# EAGLE design single supply control V13 SD4 (EAGLE 9.6.2)
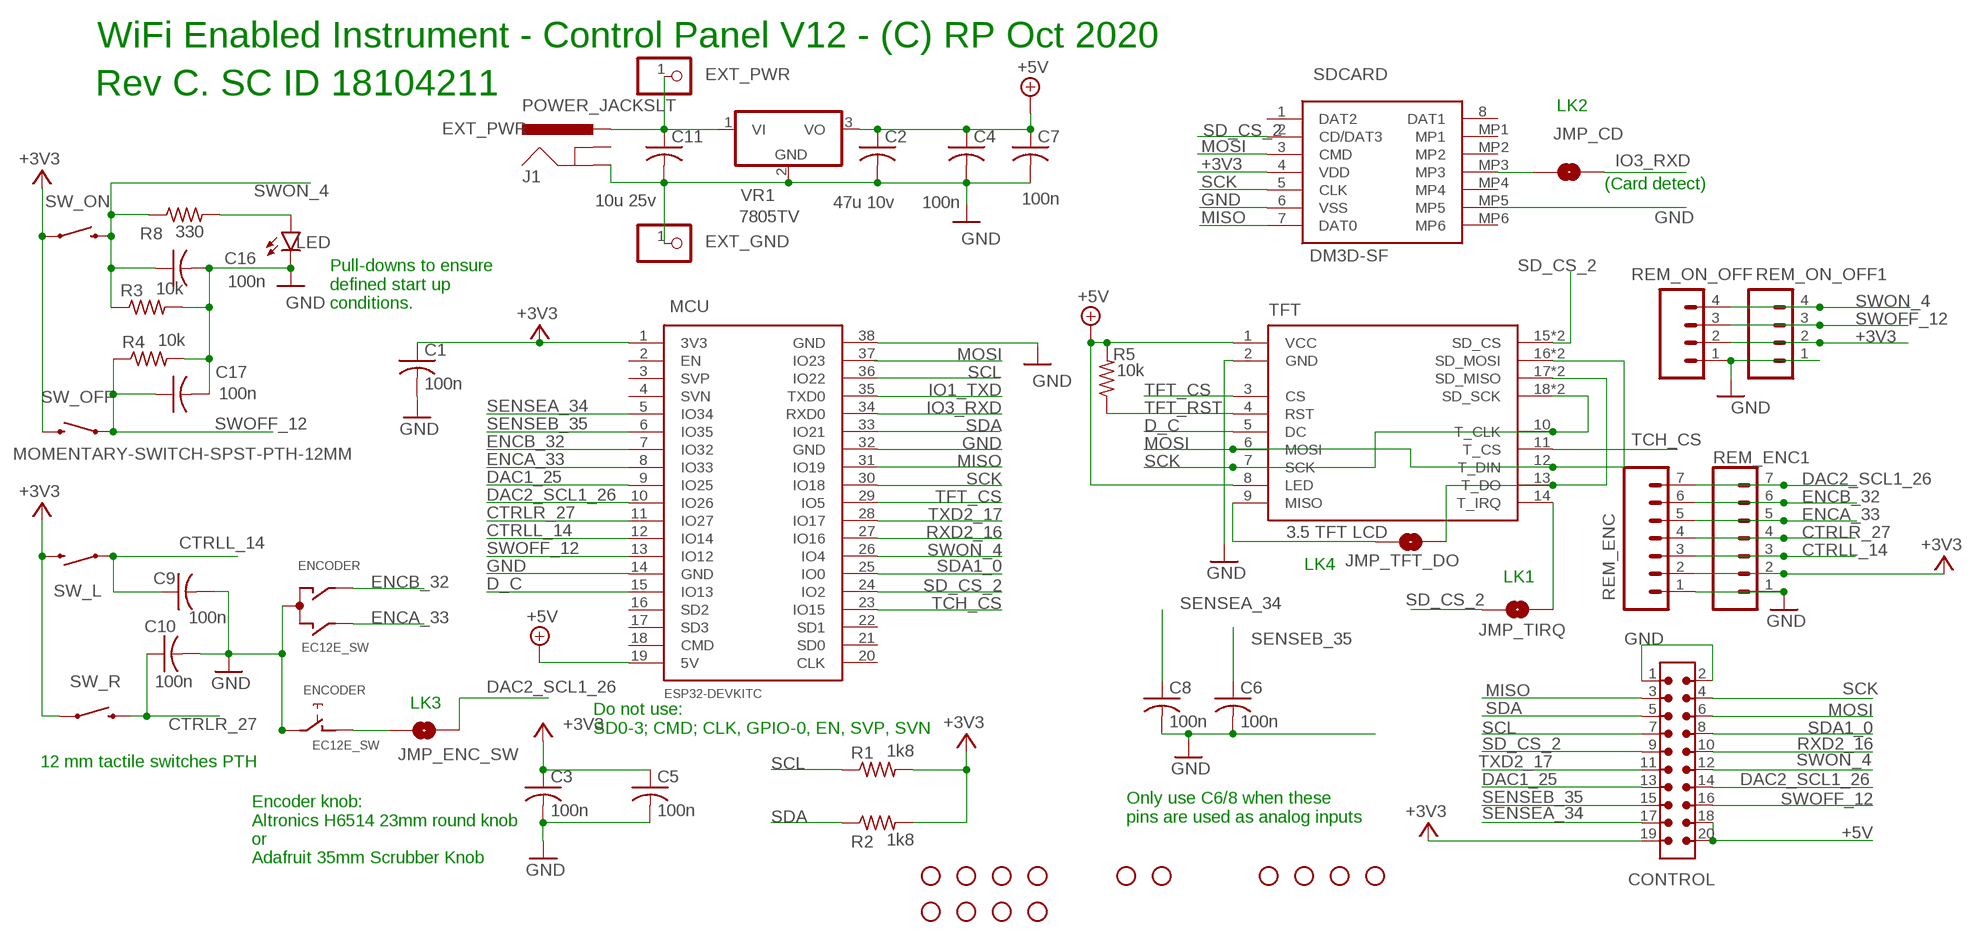
[diagram p0: schematic, sheet 1]

## Parts
C1  100n  C-USC0805K  [C0805K]
C2  47u 10v  C-USC1210K  [C1210K]
C3  100n  C-USC0805K  [C0805K]
C4  100n  C-USC0805K  [C0805K]
C5  100n  C-USC0805K  [C0805K]
C6  100n  C-USC0805K  [C0805K]
C7  100n  C-USC0805K  [C0805K]
C8  100n  C-USC0805K  [C0805K]
C9  100n  C-USC0805K  [C0805K]
C10  100n  C-USC0805K  [C0805K]
C11  10u 25v  C-USC1210K  [C1210K]
C16  100n  C-USC0805K  [C0805K]
C17  100n  C-USC0805K  [C0805K]
CONTROL  6120XX21621_61202021621  [61202021621]
ENCODER  EC12E_SW  [ALPS_EC12E_SW]
EXT_GND  PINHD-1X1  [1X01]
EXT_PWR  PINHD-1X1  [1X01]
H1  STAND-OFF  [STAND-OFF]
H2  STAND-OFF  [STAND-OFF]
H3  STAND-OFF  [STAND-OFF]
H4  STAND-OFF  [STAND-OFF]
H5  STAND-OFF  [STAND-OFF]
H6  STAND-OFF  [STAND-OFF]
H7  STAND-OFF  [STAND-OFF]
H8  STAND-OFF  [STAND-OFF]
H9  STAND-OFF  [STAND-OFF]
H10  STAND-OFF  [STAND-OFF]
H11  STAND-OFF  [STAND-OFF]
H12  STAND-OFF  [STAND-OFF]
H13  STAND-OFF  [STAND-OFF]
H14  STAND-OFF  [STAND-OFF]
J1  POWER_JACKSLT  [POWER_JACK_SLOT]
JMP_CD  JUMPER-SMT_2_NO_SILK  [SMT-JUMPER_2_NO_SILK]
JMP_ENC_SW  JUMPER-SMT_2_NO_SILK  [SMT-JUMPER_2_NO_SILK]
JMP_TFT_DO  JUMPER-SMT_2_NO_SILK  [SMT-JUMPER_2_NO_SILK]
JMP_TIRQ  JUMPER-SMT_2_NO_SILK  [SMT-JUMPER_2_NO_SILK]
LED  LED3MM  [LED_3MM]
MCU  ESP32DEVKITC  [ESP32-DEVKITC]
R1  1k8  R-US_R0805W  [R0805W]
R2  1k8  R-US_R0805W  [R0805W]
R3  10k  R-US_R0805W  [R0805W]
R4  10k  R-US_R0805W  [R0805W]
R5  10k  R-US_R0805W  [R0805W]
R8  330  R-US_R0805W  [R0805W]
REM_ENC  CONN_07  [1X07]
REM_ENC1  CONN_07  [1X07]
REM_ON_OFF  CONN_04  [1X04]
REM_ON_OFF1  CONN_04  [1X04]
SDCARD  DM3D-SF  [DM3DSF]
SW_L  MOMENTARY-SWITCH-SPST-PTH-12MM  [TACTILE_SWITCH_PTH_12MM]
SW_OFF  MOMENTARY-SWITCH-SPST-PTH-12MM  [TACTILE_SWITCH_PTH_12MM]
SW_ON  MOMENTARY-SWITCH-SPST-PTH-12MM  [TACTILE_SWITCH_PTH_12MM]
SW_R  MOMENTARY-SWITCH-SPST-PTH-12MM  [TACTILE_SWITCH_PTH_12MM]
TFT  2.8_3.5_TFT_TOUCH  [2.8_3.5_TFT_LCD]
VR1  7805TV  [TO220V]

## Nets
+3V3: C1.1 C3.1 C5.1 CONTROL.19 MCU.1(3V3) R1.2 R2.2 REM_ENC1.2 REM_ENC.2 REM_ON_OFF1.2 REM_ON_OFF.2 SDCARD.4(VDD) SW_L.3 SW_OFF.3 SW_ON.1 SW_R.1
+5V: C2.1 C4.1 C7.1 CONTROL.18 CONTROL.20 MCU.19(5V) R5.2 TFT.1(VCC) TFT.8(LED) VR1.3(VO)
CTRLL_14: C9.1 MCU.12(IO14) REM_ENC1.3 REM_ENC.3 SW_L.1
CTRLR_27: C10.1 MCU.11(IO27) REM_ENC1.4 REM_ENC.4 SW_R.3
D_C: MCU.15(IO13) TFT.5(DC)
DAC1_25: CONTROL.13 MCU.9(IO25)
DAC2_SCL1_26: CONTROL.14 JMP_ENC_SW.2 MCU.10(IO26) REM_ENC1.7 REM_ENC.7
ENC_SWX: ENCODER.D JMP_ENC_SW.1
ENCA_33: ENCODER.B MCU.8(IO33) REM_ENC1.5 REM_ENC.5
ENCB_32: ENCODER.A MCU.7(IO32) REM_ENC1.6 REM_ENC.6
EXT_PWR: C11.1 EXT_PWR.1 J1.PWR VR1.1(VI)
GND: C1.2 C2.2 C3.2 C4.2 C5.2 C6.2 C7.2 C8.2 C9.2 C10.2 C11.2 C16.2 C17.2 CONTROL.1 CONTROL.2 ENCODER.C ENCODER.E EXT_GND.1 J1.GND@2(GND) LED.K(C) MCU.14(GND) MCU.32(GND) MCU.38(GND) R3.2 R4.2 REM_ENC1.1 REM_ENC.1 REM_ON_OFF1.1 REM_ON_OFF.1 SDCARD.6(VSS) SDCARD.MP5 TFT.2(GND) VR1.2(GND)
IO1_TXD: MCU.35(TXD0)
IO3_RXD: JMP_CD.2 MCU.34(RXD0)
MISO: CONTROL.3 JMP_TFT_DO.2 MCU.31(IO19) SDCARD.7(DAT0) TFT.13(T_DO) TFT.17(SD_MISO) TFT.30(SD_MISO)
MOSI: CONTROL.6 MCU.37(IO23) SDCARD.3(CMD) TFT.6(MOSI) TFT.12(T_DIN) TFT.16(SD_MOSI) TFT.29(SD_MOSI)
N$1: JMP_CD.1 SDCARD.MP3
N$2: JMP_TFT_DO.1 TFT.9(MISO)
N$8: JMP_TIRQ.2 TFT.14(T_IRQ)
N$18: LED.A R8.2
RXD2_16: CONTROL.10 MCU.27(IO16)
SCK: CONTROL.4 MCU.30(IO18) SDCARD.5(CLK) TFT.7(SCK) TFT.10(T_CLK) TFT.18(SD_SCK) TFT.31(SD_SCK)
SCL: CONTROL.7 MCU.36(IO22) R1.1
SD_CS_2: CONTROL.9 JMP_TIRQ.1 MCU.24(IO2) SDCARD.2(CD/DAT3) TFT.15(SD_CS) TFT.28(SD_CS)
SDA: CONTROL.5 MCU.33(IO21) R2.1
SDA1_0: CONTROL.8 MCU.25(IO0)
SENSEA_34: C8.1 CONTROL.17 MCU.5(IO34)
SENSEB_35: C6.1 CONTROL.15 MCU.6(IO35)
SWOFF_12: C17.1 CONTROL.16 MCU.13(IO12) R4.1 REM_ON_OFF1.3 REM_ON_OFF.3 SW_OFF.1
SWON_4: C16.1 CONTROL.12 MCU.26(IO4) R3.1 R8.1 REM_ON_OFF1.4 REM_ON_OFF.4 SW_ON.3
TCH_CS: MCU.23(IO15) TFT.11(T_CS)
TFT_CS: MCU.29(IO5) TFT.3(CS)
TFT_RST: R5.1 TFT.4(RST)
TXD2_17: CONTROL.11 MCU.28(IO17)
Unconnected: ENCODER.GND1(G) ENCODER.GND2(G) J1.GND@1(GNDBREAK) MCU.2(EN) MCU.3(SVP) MCU.4(SVN) MCU.16(SD2) MCU.17(SD3) MCU.18(CMD) MCU.20(CLK) MCU.21(SD0) MCU.22(SD1) SDCARD.1(DAT2) SDCARD.8(DAT1) SDCARD.MP1 SDCARD.MP2 SDCARD.MP4 SDCARD.MP6

## Notes on the sheet
- WiFi Enabled Instrument - Control Panel V12 - (C) RP Oct 2020
- Rev C. SC ID 18104211
- LK2
- (Card detect)
- Pull-downs to ensure 
  defined start up 
  conditions.
- LK4
- LK1
- LK3
- Do not use:
  SD0-3; CMD; CLK, GPIO-0, EN, SVP, SVN
- 12 mm tactile switches PTH
- Only use C6/8 when these 
  pins are used as analog inputs
- Encoder knob: 
  Altronics H6514 23mm round knob 
  or
  Adafruit 35mm Scrubber Knob

## Library data of the parts
C1-C11 C16 C17 = rcl:C-US: CAPACITOR, American symbol; SPICEPREFIX: C
CONTROL = Wurth_Connectors_WR-BHD:6120XX21621_61202021621: WR-BHD 2.54 mm Male Box Header KIND PROPERTIES: Pitch 2.54 mm Gender:Male MATERIAL PROPERTIES: Insulator Material:PBT Insulator Flammability Rating UL94 V-0 Insulator Color:Black Contact Material :Copper Alloy Contact Plating :Gold Contact Type: Stamped GENERAL INFORMATION: Operating Temperature:-40 °C up to +125 °C Compliance:RoHS Working Voltage: 250 V (AC) Withstanding Voltage:500 V (AC) Contact Resistance: 20 mΩ Insulation Resistance:1000 MΩ CERTIFICATION: UL Approval:E323964 PACKAGING PROPERTIES Packaging :Tray <https://katalog.we-online.com/media/images/v2/o32884v209%20Family_WR-BHD_6120xx21621.jpg> Details see: https://katalog.we-online.com/en/em/BHD_2_54_MALE_BOX_HEADER_6120XX21621 Updated by Yingchun,Shan 2019-10-29 2019 (C) Würth Elektronik; CONTACT-RESISTANCE: 20mOhm; DATASHEET-URL: https://katalog.we-online.com/em/datasheet/61202021621.pdf; GENDER: Male; IR: 3A; L: 33.06mm; MATES: WR-BHD 2.54mm Female IDC Connector with Strain Relief; MOUNT: THT; PACKAGING: Tray; PART-NUMBER: 61202021621; PINS: 20; PITCH: 2.54mm; TOL-R: max.; TYPE: Straight; WORKING-VOLTAGE: 250V(AC)
ENCODER = switch-alps:EC12E_SW: ALPS rotary Encoder EC12E series with switch; MPN: EC12E2424407; OC_FARNELL: 1520813; OC_NEWARK: 74M1068
EXT_GND EXT_PWR = adafruit:PINHD-1X1: Pin header 1x1 for 0.1" spacing With round pins
H1-H14 = SparkFun-Hardware:STAND-OFF: Stand Off Drill holes for mechanically mounting via screws, standoffs, etc. Note: Use the keepout ring to avoid running the screw head into surrounding components. Variant Overviews STAND-OFF - Mechanical footprint for a #4 phillips button head screw. STAND-OFF-TIGHT - Mechanical footprint for a #4 phillips button head screw, Example SparkFun Products Screw - Phillips Head (1/4", 4-40, 10 pack) <https://www.sparkfun.com/products/10453> (PRT-10453) Screw - Phillips Head (1/2", 4-40, 10 pack) <https://www.sparkfun.com/products/10452> (PRT-10452) Screw - Phillips Head (3/4", 4-40, 10 pack) <https://www.sparkfun.com/products/10451> (PRT-10451) Screw - Phillips Head (1", 4-40, 10 pack) <https://www.sparkfun.com/products/10450> (PRT-10450)
J1 = SparkFun-Connectors:POWER_JACK: Power Jack Connector This is the standard 5.5mm barrel jack for power. The PTH is the most common, proven, reliable, footprint. The Slot footprint only works if the mill layer is transmitted to the PCB fab house so be warned. Here are the connectors we sell at SparkFun: DC Barrel Power Jack/Connector <https://www.sparkfun.com/products/119> (PRT-00119) DC Barrel Power Jack/Connector (SMD) <https://www.sparkfun.com/products/12748> (PRT-12748) DC Barrel Jack Adapter - Breadboard Compatible <https://www.sparkfun.com/products/10811> (PRT-10811) It is used on this SparkFun product (and many, many others): SparkFun RedBoard - Programmed with Arduino <https://www.sparkfun.com/products/12757> (DEV-12757) Also, if you need a mating power supply or connector, please check these out: Wall Adapter Power Supply - 9VDC 650mA <https://www.sparkfun.com/products/298> (TOL-00298) DC Barrel Jack Adapter - Male <https://www.sparkfun.com/products/10287> (PRT-10287); PROD_ID: PRT-00119
JMP_CD JMP_ENC_SW JMP_TFT_DO JMP_TIRQ = MY-SparkFun-Jumpers:JUMPER-SMT_2_NO: Normally open jumper This jumper has two pads in close proximity to each other. Apply solder to close the connection. Round pads are easier to solder for beginners, but are a lot larger. SparkFun Product that uses the round pads: SparkFun EL Sequencer <https://www.sparkfun.com/products/12781>
LED = SparkFun-LED:LED: LED (Generic) Standard schematic elements and footprints for 5mm, 3mm, 1206, and 0603 sized LEDs. Generic LEDs with no color specified.; PROD_ID: DIO-08794
MCU = ESP32-DEVKITCv2:ESP32DEVKITC
R1-R5 R8 = rcl:R-US_: RESISTOR, American symbol; SPICEPREFIX: R
REM_ENC REM_ENC1 = SparkFun-Connectors:CONN_07: Multi connection point. Often used as Generic Header-pin footprint for 0.1 inch spaced/style header connections On any of the 0.1 inch spaced packages, you can populate with these: Break Away Headers - Straight <https://www.sparkfun.com/products/116> (PRT-00116) Break Away Male Headers - Right Angle <https://www.sparkfun.com/products/553> (PRT-00553) Female Headers <https://www.sparkfun.com/products/115> (PRT-00115) Break Away Headers - Machine Pin <https://www.sparkfun.com/products/117> (PRT-00117) Break Away Female Headers - Swiss Machine Pin <https://www.sparkfun.com/products/743> (PRT-00743) For SCREWTERMINALS and SPRING TERMINALS visit here: Screw Terimnals on SparkFun.com <https://www.sparkfun.com/search/results?term=Screw+Terminals> (5mm/3.5mm/2.54mm spacing) This device is also useful as a general connection point to wire up your design to another part of your project. Our various solder wires solder well into these plated through hole pads. Hook-Up Wire - Assortment (Stranded, 22 AWG) <https://www.sparkfun.com/products/11375> (PRT-11375) Hook-Up Wire - Assortment (Solid Core, 22 AWG) <https://www.sparkfun.com/products/11367> (PRT-11367) View the entire wire category on our website here <https://www.sparkfun.com/categories/141> Special notes: Molex polarized connector foot print use with SKU : PRT-08231 with associated crimp pins and housings. 1MM SMD Version SKU: PRT-10208 NOTES ON THE VARIANTS LOCK and LOCK_LONGPADS... This footprint was designed to help hold the alignment of a through-hole component (i.e. 6-pin header) while soldering it into place. You may notice that each hole has been shifted either up or down by 0.005 of an inch from it's more standard position (which is a perfectly straight line). This slight alteration caused the pins (the squares in the middle) to touch the edges of the holes. Because they are alternating, it causes a "brace" to hold the component in place. 0.005 has proven to be the perfect amount of "off-center" position when using our standard breakaway headers. Although looks a little odd when you look at the bare footprint, once you have a header in there, the alteration is very hard to notice. Also,if you push a header all the way into place, it is covered up entirely on the bottom side.
REM_ON_OFF REM_ON_OFF1 = SparkFun-Connectors:CONN_04: Multi connection point. Often used as Generic Header-pin footprint for 0.1 inch spaced/style header connections On any of the 0.1 inch spaced packages, you can populate with these: Break Away Headers - Straight <https://www.sparkfun.com/products/116> (PRT-00116) Break Away Male Headers - Right Angle <https://www.sparkfun.com/products/553> (PRT-00553) Female Headers <https://www.sparkfun.com/products/115> (PRT-00115) Break Away Headers - Machine Pin <https://www.sparkfun.com/products/117> (PRT-00117) Break Away Female Headers - Swiss Machine Pin <https://www.sparkfun.com/products/743> (PRT-00743) For SCREWTERMINALS and SPRING TERMINALS visit here: Screw Terimnals on SparkFun.com <https://www.sparkfun.com/search/results?term=Screw+Terminals> (5mm/3.5mm/2.54mm spacing) This device is also useful as a general connection point to wire up your design to another part of your project. Our various solder wires solder well into these plated through hole pads. Hook-Up Wire - Assortment (Stranded, 22 AWG) <https://www.sparkfun.com/products/11375> (PRT-11375) Hook-Up Wire - Assortment (Solid Core, 22 AWG) <https://www.sparkfun.com/products/11367> (PRT-11367) View the entire wire category on our website here <https://www.sparkfun.com/categories/141> Special notes: Molex polarized connector foot print use with SKU : PRT-08231 with associated crimp pins and housings. 1MM SMD Version SKU: PRT-10208; PROD_ID: CONN-09696
SDCARD = SamacSys_Parts:DM3D-SF: Micro SD card push pull manual Source: Datasheet; DESCRIPTION: Micro SD card push pull manual; HEIGHT: 1.55mm; MANUFACTURER_NAME: Hirose; MANUFACTURER_PART_NUMBER: DM3D-SF; MOUSER_PART_NUMBER: 798-DM3D-SF; MOUSER_PRICE-STOCK: https://www.mouser.co.uk/ProductDetail/Hirose-Connector/DM3D-SF?qs=nSryOFbzj8L3f0GFYlvXkw%3D%3D
SW_L SW_OFF SW_ON SW_R = SparkFun-Switches:MOMENTARY-SWITCH-SPST: Momentary Switch (Pushbutton) - SPST Normally-open (NO) SPST momentary switches (buttons, pushbuttons). Variants PTH-12MM - 12mm square, through-hole Momentary Pushbutton Switch - 12mm Square <https://www.sparkfun.com/products/9190> (COM-09190) PTH-6.0MM, PTH-6.0MM-KIT - 6.0mm square, through-hole Mini Pushbutton Switch <https://www.sparkfun.com/products/97> (COM-00097) KIT package intended for soldering kit's - only one side of pads' copper is exposed. PTH-RIGHT-ANGLE-KIT - Right-angle, through-hole Right Angle Tactile Button <https://www.sparkfun.com/products/10791> - Used on SparkFun BigTime Watch Kit <https://www.sparkfun.com/products/11734> SMD-12MM - 12mm square, surface-mount Tactile Button - SMD (12mm) <https://www.sparkfun.com/products/12993> (COM-12993) Used on SparkFun PicoBoard <https://www.sparkfun.com/products/11888> SMD-4.5MM - 4.5mm Square Trackball Switch Used on SparkFun Blackberry Trackballer Breakout <https://www.sparkfun.com/products/13169> SMD-4.6MMX2.8MM - 4.60mm x 2.80mm, surface mount Used on SparkFun SAMD21 Mini Breakout <https://www.sparkfun.com/products/13664> SMD-5.2MM, SMD-5.2-REDUNDANT - 5.2mm square, surface-mount Mini Pushbutton Switch - SMD <https://www.sparkfun.com/products/8720> (COM-08720) Used on Arduino Pro Mini <https://www.sparkfun.com/products/11114> REDUNDANT package connects both switch circuits together SMD-6.0X3.5MM - 6.0 x 3.5mm, surface mount Momentary Reset Switch SMD <https://www.sparkfun.com/products/8229> (COM-08229) SMD-6.2MM-TALL - 6.2mm square, surface mount Tactile Button - SMD (6mm) <https://www.sparkfun.com/products/12992> Used on SparkFun Digital Sandbox <https://www.sparkfun.com/products/12651> SMD-RIGHT-ANGLE - Right-angle, surface mount Used on SparkFun Block for Intel® Edison - Arduino <https://www.sparkfun.com/products/13036>; PROD_ID: SWCH-09185; SF_SKU: COM-09190
TFT = Aldar:2.8_3.5_TFT_TOUCH
VR1 = linear:78*: Positive VOLTAGE REGULATOR Source: http://cache.national.com/ds/LM/LM78L05.pdf http://www.fairchildsemi.com/ds/LM/LM7805.pdf

## Board
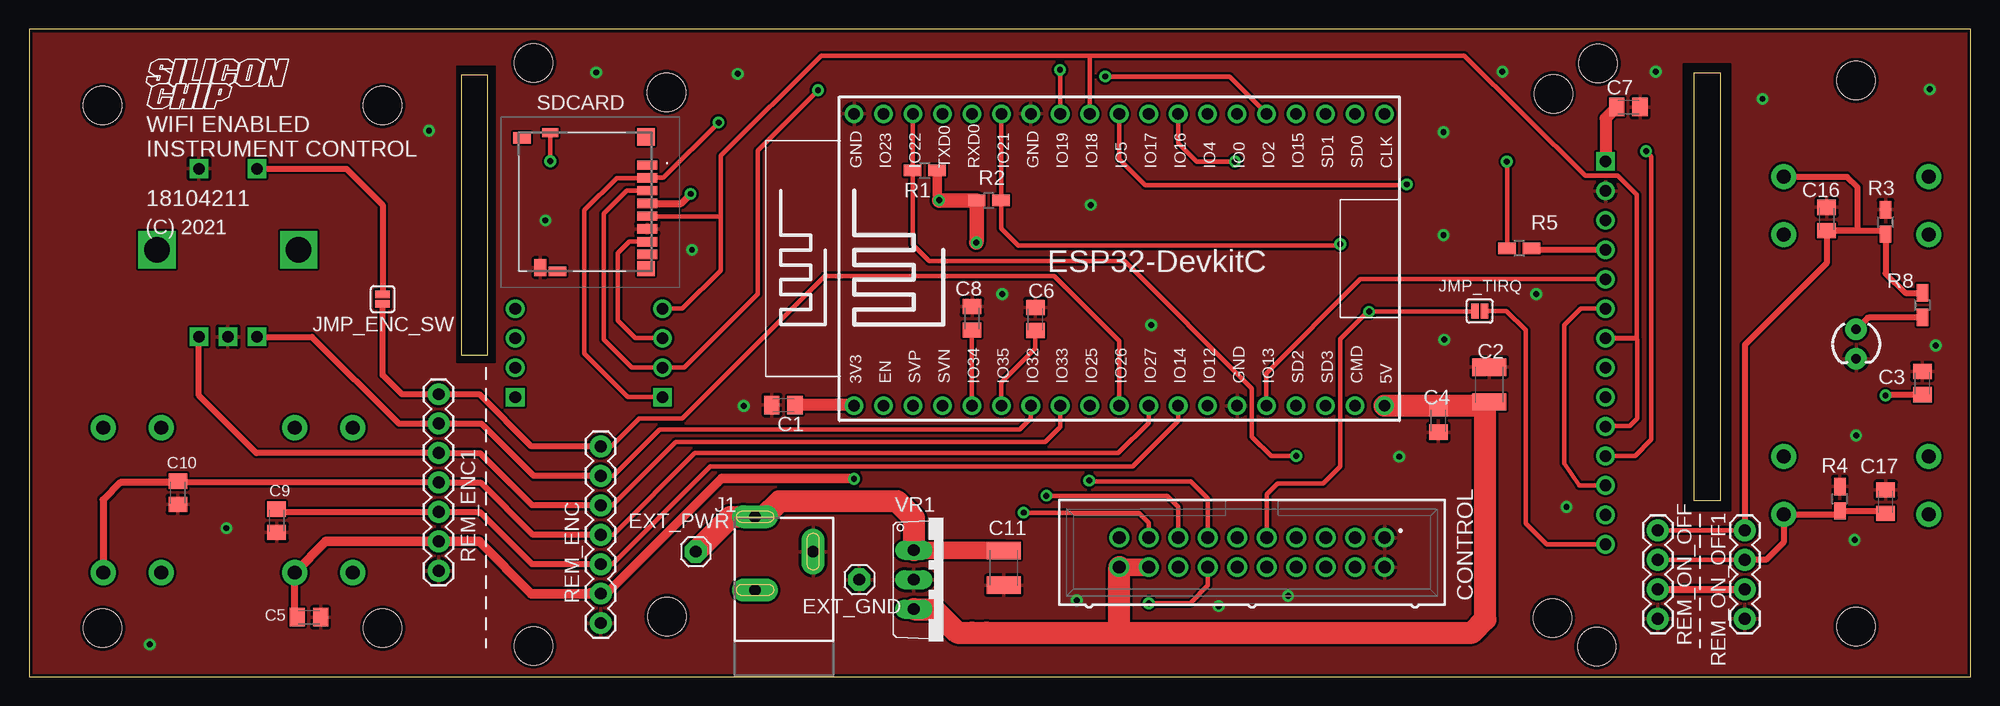
[diagram p1: board, top side]
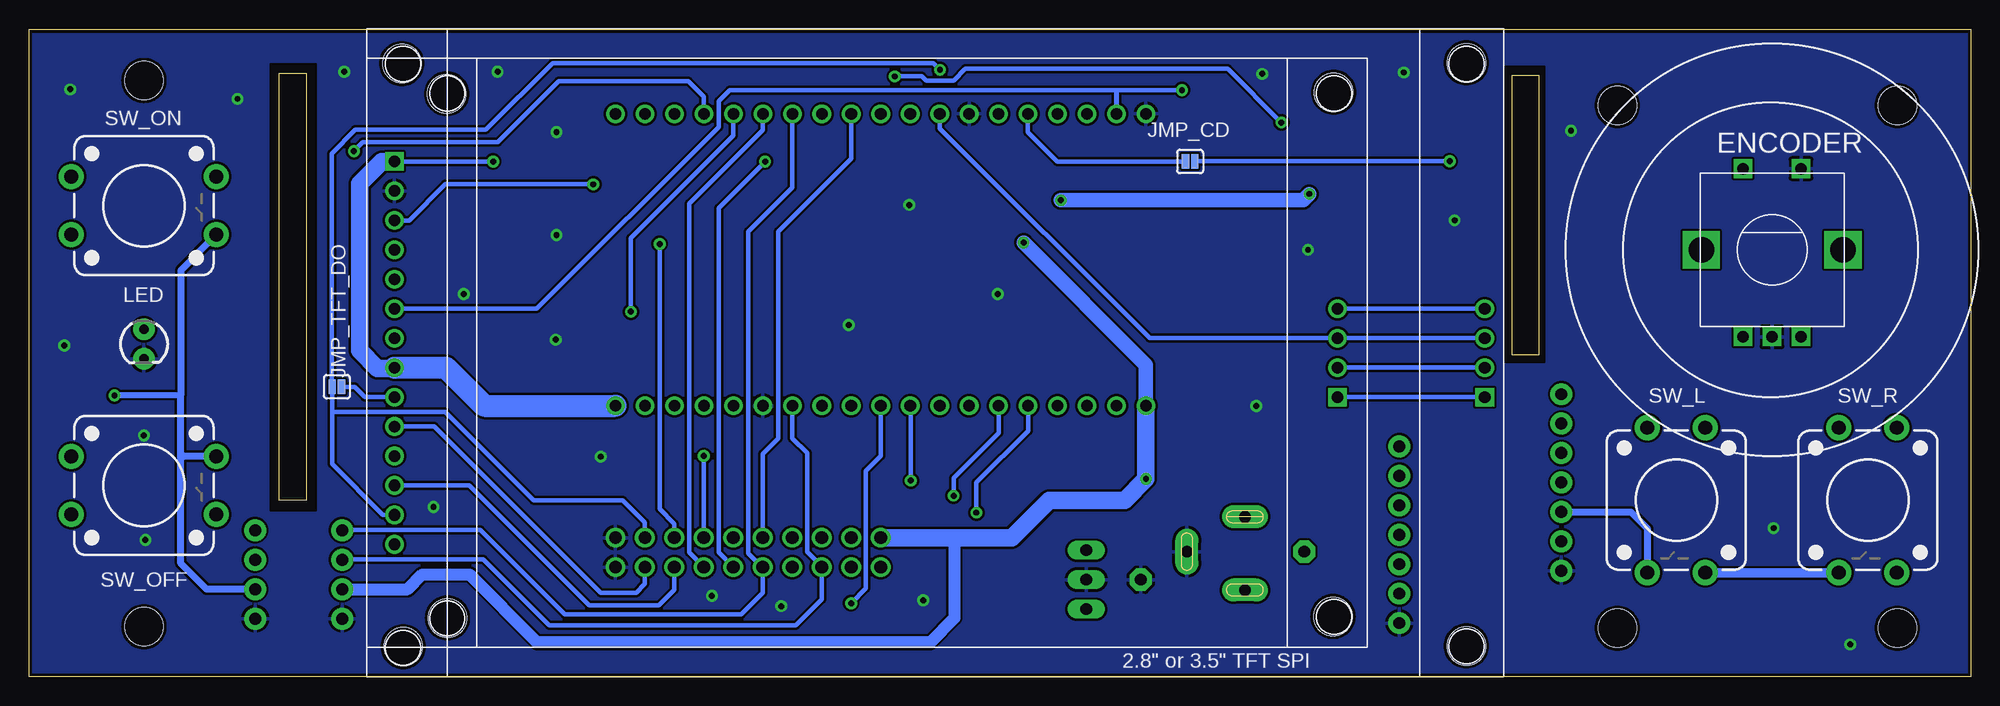
[diagram p2: board, bottom side, seen from below]

Size 167.39 x 55.88 mm. Coordinates in mm from the lower left corner, seen from the top.
Outline: 0,0 167.39,0 167.39,55.88 0,55.88 0,0
Copper layers (1*16): Top 0.035mm / dielectric 1.5mm / Bottom 0.035mm
Design rules "SparkFun": minimum track width 8mil, minimum drill 20mil, track to track 8mil, track to pad 8mil, pad to pad 8mil, via to via 8mil, smd to smd 8mil, copper to edge 10mil, drill to drill 8mil, minimum pad ring 12mil, minimum via ring 10mil, stop-mask expansion 4mil, vias tented up to drill 25mil, thermal gap 10mil
Milling: area 37.3,27.7 to 39.6,51.9; area 143.5,15.2 to 145.8,52.1

### Footprints (pad centres in the part's own frame; a part is rotated, then mirrored left to right if it is on the bottom)
C0805K = smd 1.3 x 1.6: 1 -1,0; 2 1,0
C1210K = smd 1.5 x 2.9: 1 -1.5,0; 2 1.5,0
61202021621 = drill 1.1: 1 -11.43,-1.27; 2 -11.43,1.27; 3 -8.89,-1.27; 4 -8.89,1.27; 5 -6.35,-1.27; 6 -6.35,1.27; 7 -3.81,-1.27; 8 -3.81,1.27; 9 -1.27,-1.27; 10 -1.27,1.27; 11 1.27,-1.27; 12 1.27,1.27; 13 3.81,-1.27; 14 3.81,1.27; 15 6.35,-1.27; 16 6.35,1.27; 17 8.89,-1.27; 18 8.89,1.27; 19 11.43,-1.27; 20 11.43,1.27
ALPS_EC12E_SW = drill 1 square: A -2.5,-7.5; B 2.5,-7.5; C 0,-7.5; D -2.5,7; E 2.5,7 | drill 2.2 square: GND1 -6.1,0; GND2 6.1,0
1X01 = drill 1.016 pad 1.93 octagon: 1 0,0
STAND-OFF = hole 3.302: 0,0
POWER_JACK_SLOT = drill 1 pad 2 long: GND@1 2.58,7.5; GND@2 7.58,10.8; PWR 2.58,13.8
SMT-JUMPER_2_NO_SILK = smd 0.635 x 1.27: 1 -0.406,0; 2 0.406,0
LED_3MM = drill 0.813 pad 1.88: A -1.27,0; K 1.27,0
ESP32-DEVKITC = drill 1 pad 1.422: 1 -22.87,-11.42; 2 -20.33,-11.42; 3 -17.79,-11.42; 4 -15.25,-11.42; 5 -12.71,-11.42; 6 -10.17,-11.42; 7 -7.63,-11.42; 8 -5.09,-11.42; 9 -2.55,-11.42; 10 -0.01,-11.42; 11 2.53,-11.42; 12 5.07,-11.42; 13 7.61,-11.42; 14 10.15,-11.42; 15 12.69,-11.42; 16 15.23,-11.42; 17 17.77,-11.42; 18 20.31,-11.42; 19 22.85,-11.42; 20 22.85,13.77; 21 20.31,13.77; 22 17.77,13.77; 23 15.23,13.77; 24 12.69,13.77; 25 10.15,13.77; 26 7.61,13.77; 27 5.07,13.77; 28 2.53,13.77; 29 -0.01,13.77; 30 -2.55,13.77; 31 -5.09,13.77; 32 -7.63,13.77; 33 -10.17,13.77; 34 -12.71,13.77; 35 -15.25,13.77; 36 -17.79,13.77; 37 -20.33,13.77; 38 -22.87,13.77
R0805W = smd 1.5 x 1: 1 -1.052,0; 2 1.052,0
1X07 = drill 1.016 pad 1.88: 1 0,0; 2 2.54,0; 3 5.08,0; 4 7.62,0; 5 10.16,0; 6 12.7,0; 7 15.24,0
1X04 = drill 1.016 pad 1.88: 1 0,0; 2 2.54,0; 3 5.08,0; 4 7.62,0
DM3DSF = smd 0.8 x 1.75: 1 3.175,-5.35; 2 2.075,-5.35; 3 0.975,-5.35; 4 -0.125,-5.35; 5 -1.225,-5.35; 6 -2.325,-5.35; 7 -3.425,-5.35; 8 -4.525,-5.35 | smd 1.5 x 1.5: MP1 5.625,-5.225 | smd 1.3 x 1.5: MP2 -5.725,-5.225 | smd 0.8 x 1.4: MP3 5.975,3.025 | smd 1 x 1.55: MP4 5.525,5.45 | smd 1.45 x 1: MP5 -5.65,3.875 | smd 0.8 x 1.5: MP6 -5.975,2.375
TACTILE_SWITCH_PTH_12MM = drill 1.2 pad 2.159: 1 6.25,-2.5; 2 -6.25,-2.5; 3 6.25,2.5; 4 -6.25,2.5
2.8_3.5_TFT_LCD = drill 1 square: 1 2.54,44.45; 15 96.52,24.13; 28 83.82,24.13 | drill 1: 2 2.54,41.91; 3 2.54,39.37; 4 2.54,36.83; 5 2.54,34.29; 6 2.54,31.75; 7 2.54,29.21; 8 2.54,26.67; 9 2.54,24.13; 10 2.54,21.59; 11 2.54,19.05; 12 2.54,16.51; 13 2.54,13.97; 14 2.54,11.43; 16 96.52,26.67; 17 96.52,29.21; 18 96.52,31.75; 29 83.82,26.67; 30 83.82,29.21; 31 83.82,31.75
TO220V = drill 1.016 long: 1 -2.54,-2.54; 2 0,-2.54; 3 2.54,-2.54

### Placement (x,y rotation side)
C1  65.02,23.43 180 top
C2  125.86,25.21 90 top
C3  163.19,25.34 90 top
C4  121.48,22.1 270 top
C5  24.13,5.14 0 top
C6  86.74,30.86 90 top
C7  137.86,49.15 0 top
C8  81.28,30.92 90 top
C9  21.34,13.46 270 top
C10  12.83,15.87 270 top
C11  84.01,9.4 270 top
C16  154.94,39.5 90 top
C17  160.02,15.11 90 top
CONTROL  105.41,10.73 180 top
ENCODER  17.14,36.83 0 bottom
EXT_GND  71.56,8.38 0 top
EXT_PWR  57.47,10.79 0 top
H1  6.35,49.28 0 top
H2  30.48,4.19 0 top
H3  30.48,49.28 0 top
H4  6.35,4.19 0 top
H5  54.99,5.21 0 top
H6  131.32,5.08 0 top
H7  54.93,50.42 0 top
H8  131.38,50.29 0 top
H9  157.48,4.32 0 top
H10  157.48,51.43 0 top
H11  43.5,2.67 0 top
H12  135.13,2.6 0 top
H13  43.5,52.96 0 top
H14  135.25,52.9 0 top
J1  60.01,0 0 top
JMP_CD  67.31,44.45 180 bottom
JMP_ENC_SW  30.48,32.58 270 top
JMP_TFT_DO  140.84,25.02 180 bottom
JMP_TIRQ  125.03,31.56 0 top
LED  157.48,28.7 270 bottom
MCU  93.98,34.8 0 top
R1  77.22,43.69 0 top
R2  82.74,41.08 180 top
R3  160.02,39.24 90 top
R4  156.08,15.37 90 top
R5  128.46,36.96 180 top
R8  163.19,32.07 270 top
REM_ENC  49.28,4.64 90 top
REM_ENC1  35.31,9.14 90 top
REM_ON_OFF  140.4,5.02 90 top
REM_ON_OFF1  147.89,5.02 90 top
SDCARD  47.94,40.96 90 top
SW_L  25.4,15.24 270 bottom
SW_OFF  157.48,16.51 0 bottom
SW_ON  157.48,40.64 0 bottom
SW_R  8.89,15.24 270 bottom
TFT  138.43,0 0 bottom
VR1  78.8,8.38 270 top

### Tracks (layer width: path | path; a pad name or v marks a point on that pad's centre or on a via)
+3V3  (via drill 0.51)
  Top 0.406: R2.2 78.74,41.09 78.27,41.56
  Top 0.508: C3.1 163.19,24.32 160.08,24.32 v160.02,24.26
  Top 0.61: REM_ON_OFF.2 REM_ON_OFF1.2 | C5.1 22.9,5.37 SW_L.3 | SDCARD.4 56.2,40.83 v57.02,41.66
  Top 0.813: SW_L.3 25.59,11.68 REM_ENC1.2 38.8,11.68 43.31,7.18 REM_ENC.2 48.32,7.24 49.85,7.24 59.7,17.09 71.12,17.09 v71.12,17.09 v71.11,17.08 | R1.2 78.27,41.56
  Top 1.016: MCU.1 71.06,23.43 C1.1
  Top 1.27: v78.44,41.1 78.46,41.09 R2.2 81.69,37.71 v81.66,37.46
  Bottom 0.508: v160.02,24.26 159.96,24.32 154.31,24.32
  Bottom 0.61: REM_ON_OFF1.2 152.08,7.56 154.31,9.78 154.31,19.25 | 154.31,19.25 154.31,24.32 154.31,35.05 151.23,38.13 SW_ON.1 | 154.31,19.25 154.06,19.01 SW_OFF.3
  Bottom 0.813: SW_L.3 SW_R.1
  Bottom 1.016: 87.63,12 87.63,5.08 89.72,2.98 123.57,2.98 129.41,8.83 133.48,8.83 134.75,7.56 REM_ON_OFF.2
  Bottom 1.27: MCU.1 71.11,26.91 v81.66,37.46 | v78.44,41.1 57.57,41.1 v57.02,41.66
  Bottom 1.524: CONTROL.19 87.63,12 82.68,12 79.44,15.24 72.95,15.24 v71.11,17.08 MCU.1
+5V  (via drill 0.51)
  Top 0.406: v127.38,44.45 127.41,44.42 R5.2 | C2.1 125.86,23.7 125.54,23.38
  Top 0.813: MCU.19 121.47,23.38 C4.1
  Top 1.016: C7.1 135.89,48.18 TFT.1
  Top 1.524: CONTROL.20 CONTROL.18
  Top 1.905: 94.49,3.81 93.98,4.32 CONTROL.20 | 94.49,3.81 124.4,3.81 125.54,4.95 125.54,23.38 MCU.19 | VR1.3 77.98,5.84 80.01,3.81 81.28,3.81 82.55,3.81 94.49,3.81
  Bottom 0.406: TFT.1 v127.38,44.45
  Bottom 1.524: TFT.1 136.97,44.45 138.87,42.54 138.87,28.13 137.36,26.61 135.95,26.61 TFT.8
  Bottom 1.905: TFT.8 131.44,26.67 128.14,23.37 116.84,23.37 MCU.19
CTRLL_14
  Top 0.406: REM_ENC.3 50.29,9.71 58.74,18.16 95.12,18.16 99.05,22.09 MCU.12
  Top 0.508: REM_ENC.3 43.37,9.71 38.86,14.22 REM_ENC1.3 21.57,14.22 C9.1
  Bottom 0.61: REM_ENC1.3 29.32,14.22 27.9,12.8 SW_L.1
CTRLR_27
  Top 0.406: REM_ENC.4 50.36,12.26 57.4,19.3 93.9,19.3 96.51,21.92 MCU.11
  Top 0.508: REM_ENC.4 43.43,12.26 38.93,16.76 REM_ENC1.4 12.94,16.76 C10.1 12.72,16.76
  Top 0.61: SW_R.3 6.39,15.28 7.87,16.76 12.72,16.76
D_C
  Top 0.406: MCU.15 106.62,23.43 106.62,26.17 114.75,34.29 TFT.5
DAC1_25  (via drill 0.51)
  Top 0.406: v91.38,16.93 91.44,16.87 100.11,16.87 101.6,15.38 CONTROL.13
  Bottom 0.406: MCU.9 91.38,23.32 v91.38,16.93
DAC2_SCL1_26  (via drill 0.51)
  Top 0.406: REM_ENC.7 50.16,19.88 52.58,22.29 56.33,22.29 68.61,34.57 88.37,34.57 93.97,28.97 MCU.10 | v96.52,6.35 100.08,6.35 101.6,7.87 CONTROL.14
  Top 0.508: REM_ENC.7 43.31,19.88 38.8,24.38 REM_ENC1.7 32.13,24.38 30.48,26.04 JMP_ENC_SW.2
  Bottom 0.406: MCU.10 93.98,23.37 93.98,19.05 95.25,17.78 95.25,7.62 v96.52,6.35
ENC_SWX
  Top 0.508: ENCODER.D 27.35,43.83 30.48,40.7 JMP_ENC_SW.1
ENCA_33
  Top 0.406: REM_ENC.5 50.29,14.79 55.75,20.26 87.61,20.26 88.89,21.54 MCU.8
  Top 0.508: ENCODER.B 14.65,24.25 19.59,19.3 REM_ENC1.5 38.86,19.3 43.37,14.79 REM_ENC.5
ENCB_32
  Top 0.406: REM_ENC.6 50.36,17.34 54.36,21.34 85.39,21.34 86.35,22.3 MCU.7
  Top 0.508: ENCODER.A 24.39,29.33 31.88,21.84 REM_ENC1.6 38.99,21.84 43.5,17.34 REM_ENC.6
EXT_PWR
  Top 1.524: VR1.1 84.01,10.92 C11.1
  Top 1.905: VR1.1 76.26,13.7 74.82,15.14 64.69,15.14 63.35,13.8 J1.PWR 60.44,13.77 EXT_PWR.1
GND  (via drill 0.51)
  other vias: 48.89,52.13 10.41,2.79 163.83,50.67 157.35,11.81 140.22,52.2 127,52.2 157.48,20.83 61.59,23.37 129.92,33.02 83.88,33.02 61.09,52.01 90.3,6.6 34.48,47.12 17.02,12.83 57.15,36.83 164.34,28.57 108.52,6.98 102.55,6.1 132.52,14.67 149.42,49.85 96.72,30.35 91.52,40.7 121.92,46.99 121.92,38.1 44.51,39.37 118.11,18.99 121.98,29.08
  pour Bottom (rank 2): 167.58,-0.25 0,-0.25 0,56.13 167.58,56.13
  pour Top: 0,55.88 167.58,55.88 167.58,-0.25 0,-0.25
  cutout Top: 142.62,52.83 146.62,52.83 146.62,14.35 142.62,14.35
  cutout Bottom: 142.68,52.83 146.56,52.83 146.56,14.35 142.68,14.35
  cutout Top: 36.89,52.64 40.13,52.64 40.13,27.18 36.89,27.18
  cutout Bottom: 36.77,52.64 40.13,52.64 40.13,27.18 36.77,27.18
IO3_RXD
  Bottom 0.406: MCU.34 81.28,48.56 81.28,46.99 78.74,44.45 JMP_CD.2
MISO  (via drill 0.51)
  Top 0.406: MCU.31 88.86,48.59 v88.86,52.35 | TFT.30 52.26,29.21 50.74,30.73 50.74,36.56 51.72,37.53 SDCARD.7
  Bottom 0.406: TFT.13 136.88,13.97 141.26,18.35 141.26,22.86 | 141.26,22.86 141.26,25.01 JMP_TFT_DO.2 141.29,25.06 141.29,45.15 139.25,47.18 128.02,47.18 122.26,52.93 89.45,52.93 v88.86,52.35 | CONTROL.3 114.3,13.33 116.2,15.24 123.89,15.24 131.51,22.86 141.26,22.86 | MCU.31 88.89,47.3 70.8,29.21 TFT.30 TFT.17
MOSI  (via drill 0.51)
  Top 0.406: TFT.12 133.63,16.51 132.33,18.43 132.33,30.35 133.73,31.75 TFT.6 | v68.01,50.61 62.8,45.4 62.8,33.01 56.46,26.67 TFT.29 51.94,26.67 49.53,29.08 49.53,39.94 51.52,41.93 SDCARD.3
  Bottom 0.406: CONTROL.6 111.76,7.49 113.09,6.16 119.09,6.16 129.44,16.51 TFT.12 | TFT.6 123.62,31.75 107.95,47.42 107.95,49.66 107,50.61 73.66,50.61 MCU.37 73.65,50.61 v68.01,50.61 | TFT.16 TFT.29
N$1  (via drill 0.51)
  Top 0.406: v44.94,44.47 44.92,44.48 SDCARD.MP3
  Bottom 0.406: v44.94,44.47 66.74,44.47 66.76,44.45 JMP_CD.1
N$2
  Bottom 0.406: TFT.9 138.43,24.13 139.32,25.02 JMP_TFT_DO.1
N$8
  Top 0.406: JMP_TIRQ.2 127.34,31.56 128.99,29.91 128.99,13.25 130.81,11.43 TFT.14
N$18
  Top 0.508: LED.A 158.47,30.96 158.65,31.02 R8.2
RXD2_16  (via drill 0.51)
  Top 0.406: MCU.27 99.05,46.03 100.64,44.44 v103.94,44.44
  Bottom 0.406: v103.94,44.44 107.94,40.45 107.94,10.72 CONTROL.10
SCK
  Top 0.406: TFT.10 135.93,21.63 137.96,21.63 138.63,22.3 138.63,29.07 138.52,29.18 135.91,29.18 TFT.7 138.59,29.21 138.59,41.6 136.96,43.23 134.12,43.23 123.7,53.59 91.43,53.59 | 91.43,53.59 68.28,53.59 59.63,44.96 59.63,39.69 | 91.43,53.59 MCU.30 91.43,53.59 | TFT.31 56.32,31.75 59.63,35.05 59.63,39.69 | SDCARD.5 53.33,39.69 59.63,39.69
  Bottom 0.406: CONTROL.4 114.3,8 115.06,7.24 118.11,7.24 132.46,21.59 TFT.10 | TFT.18 TFT.31
SCL  (via drill 0.51)
  Top 0.305: R1.1 76.16,44.42 76.19,44.45
  Top 0.406: MCU.36 76.19,44.45 76.19,37.28 77.6,35.88 94.42,35.88 105.41,24.89 105.41,20.7 107.06,19.05 v109.22,19.05
  Bottom 0.406: v109.22,19.05 CONTROL.7
SD_CS_2  (via drill 0.51)
  Top 0.406: CONTROL.9 106.68,15.75 107.63,16.7 111.57,16.7 113.03,18.16 113.03,29.15 115.38,31.5 v115.51,31.5 124.56,31.5 JMP_TIRQ.1 | MCU.24 103.49,51.75 92.8,51.75 v92.76,51.79 | v59.44,47.82 54.67,43.05 53.31,43.05 SDCARD.2 50.65,43.03 47.88,40.26 47.88,27.88 51.63,24.13 TFT.28
  Bottom 0.406: MCU.24 106.67,46.66 115.51,37.83 v115.51,31.5 | TFT.28 TFT.15 | v92.76,51.79 90.42,51.79 90.07,51.44 87.69,51.44 86.68,52.45 64.07,52.45 v59.44,47.82
SDA  (via drill 0.51)
  Top 0.406: MCU.33 83.81,41.07 83.81,38.68 85.28,37.21 112.9,37.21 v113.03,37.34
  Top 0.508: R2.1 83.81,41.07
  Bottom 0.406: v113.03,37.34 113.03,14.48 111.76,13.21 CONTROL.5
SDA1_0
  Bottom 0.406: MCU.25 104.13,47.17 110.48,40.82 110.48,10.72 CONTROL.8
SENSEA_34  (via drill 0.51)
  Top 0.406: v85.72,14.16 85.75,14.13 95.66,14.13 96.52,13.27 CONTROL.17 | C8.1 MCU.5
  Bottom 0.406: MCU.5 81.27,21.22 85.72,16.76 v85.72,14.16
SENSEB_35  (via drill 0.51)
  Top 0.406: v87.69,15.62 98.11,15.62 99.06,14.67 CONTROL.15 | C6.1 86.74,28.32 83.81,25.39 MCU.6
  Bottom 0.406: v87.69,15.62 87.69,17.14 83.81,21.03 MCU.6
SWOFF_12
  Top 0.406: REM_ON_OFF.3 REM_ON_OFF1.3
  Top 0.508: REM_ON_OFF1.3 149.73,10.1 151.23,11.59 SW_OFF.1 155.78,14.01 R4.1 159.82,14.31 C17.1
  Bottom 0.406: MCU.13 101.59,20.56 100.32,19.29 100.32,15.99 100.32,10.79 99.06,9.53 CONTROL.16 99.06,6.67 101.28,4.45 122.53,4.45 128.22,10.13 140.37,10.13 REM_ON_OFF.3
SWON_4
  Top 0.406: REM_ON_OFF.4 REM_ON_OFF1.4
  Top 0.508: C16.1 159.84,38.5 R3.1 160.02,34.79 161.76,33.12 R8.1 | SW_ON.3 156.69,43.14 157.61,42.23 157.61,38.48 154.96,38.48 C16.1 | C16.1 154.94,35.69 147.89,28.64 REM_ON_OFF1.4
  Bottom 0.406: MCU.26 101.59,42.22 105.4,38.41 105.4,10.66 104.2,9.46 CONTROL.12 104.14,7.24 105.98,5.4 121.22,5.4 128.49,12.67 140.37,12.67 REM_ON_OFF.4
TCH_CS  (via drill 0.51)
  Top 0.406: v139.38,45.34 139.84,44.88 139.84,20.46 138.43,19.05 TFT.11
  Bottom 0.406: MCU.23 109.21,50.03 110.55,51.37 121.73,51.37 127,46.1 138.62,46.1 v139.38,45.34
TFT_CS  (via drill 0.51)
  Top 0.406: v118.75,42.48 118.68,42.42 96.2,42.42 93.97,44.65 MCU.29
  Bottom 0.406: TFT.3 134.62,39.37 131.51,42.48 v118.75,42.48
TFT_RST
  Top 0.508: TFT.4 129.51,36.83 R5.1
TXD2_17
  Bottom 0.406: MCU.28 96.51,44.7 102.81,38.4 102.81,20.57 104.14,19.24 CONTROL.11

### Text on the board
tNames: WIFI ENABLED / INSTRUMENT CONTROL / / 18104211 | (C) 2021